# Altium schematic sheet Power_Management.SchDoc
size A4; SheetNumber: 3; SheetTotal: 4
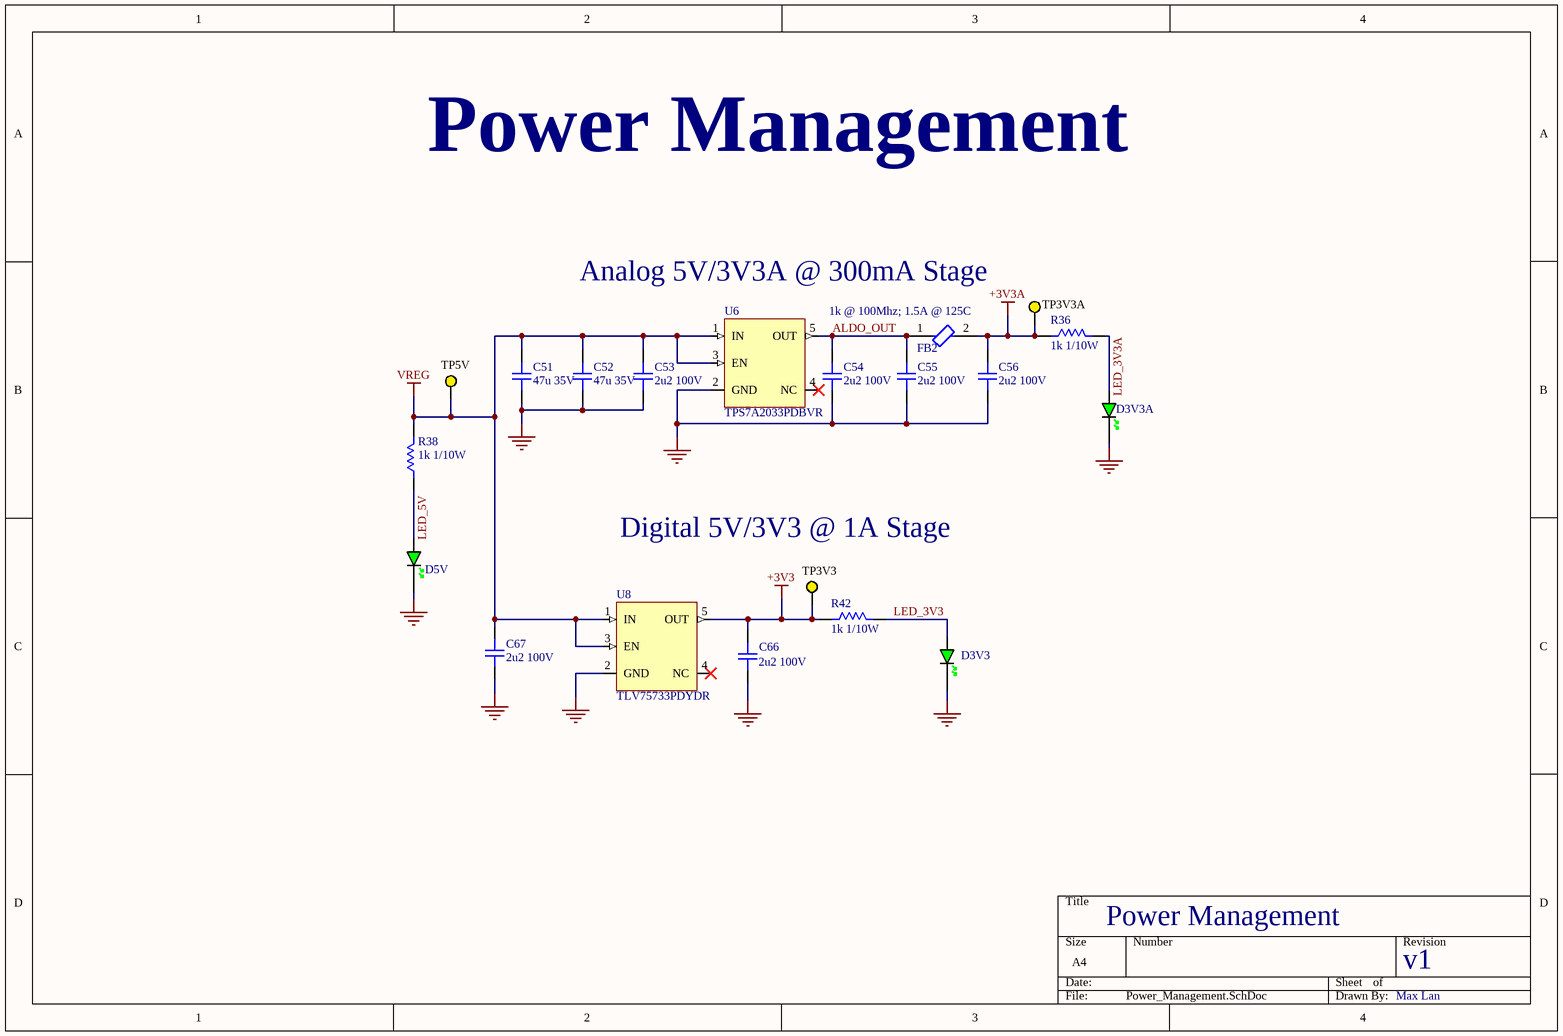
[diagram p0: Power_Management.SchDoc]

## Parts
C51  47u 35V  [CAP_2220]
C52  47u 35V  [CAP_2220]
C53  2u2 100V  [CAP_1210]
C54  2u2 100V  [CAP_1210]
C55  2u2 100V  [CAP_1210]
C56  2u2 100V  [CAP_1210]
C66  2u2 100V  [CAP_1210]
C67  2u2 100V  [CAP_1210]
D3V3  GREEN  [LED_0603_GREEN]  (value not drawn)
D3V3A  GREEN  [LED_0603_GREEN]  (value not drawn)
D5V  GREEN  [LED_0603_GREEN]  (value not drawn)
FB2  1k @ 100Mhz; 1.5A @ 125C  [FP-MPZ2012-MFG]
R36  1k 1/10W  [RES_0603]
R38  1k 1/10W  [RES_0603]
R42  1k 1/10W  [RES_0603]
TP3V3  5014  [KSTN-5014_V]  (value not drawn)
TP3V3A  5014  [KSTN-5014_V]  (value not drawn)
TP5V  5014  [KSTN-5014_V]  (value not drawn)
U6  TPS7A2033PDBVR  [TPS7A2033PDBVR]
U8  TLV75733PDYDR  [TLV75733PDYDR]

## Nets
+3V3: C66.2 R42.1 TP3V3.1 U8.5(OUT)
+3V3A: C56.2 FB2.2 R36.1 TP3V3A.1
GND: C51.1 C52.1 C53.1 C54.1 C55.1 C56.1 C66.1 C67.1 D3V3.K D3V3A.K D5V.K U6.2(GND) U8.2(GND)
VREG: C51.2 C52.2 C53.2 C67.2 R38.1 TP5V.1 U6.1(IN) U6.3(EN) U8.1(IN) U8.3(EN)
ALDO_OUT: C54.2 C55.2 FB2.1 U6.5(OUT)
LED_3V3: D3V3.A R42.2
LED_3V3A: D3V3A.A R36.2
LED_5V: D5V.A R38.2

Not connected (* = marked no-connect by the designer): U6 4(NC)*; U8 4(NC)*

## Notes on the sheet
- Power Management
- Analog 5V/3V3A @ 300mA Stage
- Digital 5V/3V3 @ 1A Stage
- v1
- Max Lan

## Library data of the parts
C51 C52 = C5750X7R1V476M230KC: MLCC - SMD/SMT 2220 35VDC 47uF 20% X7R; Manufactuer Name: TDK; ComponentLink1Description: Datasheet Link; ComponentLink1URL: https://product.tdk.com/system/files/dam/doc/product/capacitor/ceramic/mlcc/catalog/mlcc_commercial_highvoltage_en.pdf; Distributor Name: Mouser; ComponentLink2Description: Distributor Link; ComponentLink2URL: https://www.mouser.tw/zh/ProductDetail/TDK/C5750X7R1V476M230KC?qs=rSMjJ%252B1ewcSIfs95ZgB3Sw%3D%3D
C53-C56 C66 C67 = C1210C225J1RACAUTO: Multilayer Ceramic Capacitors MLCC - SMD/SMT 100V 2.2uF X7R 1210 5% AEC-Q200; Manufacturer: KEMET; Rating: 2.2uF 100V X7R 1210 5%; Manufacturer Part Number: C1210C225J1RACAUTO; Distributor Link: https://www.mouser.tw/en/ProductDetail/KEMET/C1210C225J1RACAUTO?qs=sGAEpiMZZMvsSlwiRhF8qtbmv%2FbKa1yYzrRuCBjX9aFrg%252BEkfh5A0g%3D%3D; Datasheet Link: https://www.mouser.tw/datasheet/3/508/1/KEM_C1023_X7R_AUTO_SMD.pdf; Dielectric: *
D3V3 D3V3A D5V = LED_0603_GREEN: LED 0603 GREEN SMD
FB2 = CMP-08257-000025-1: FERRITE BEAD 1 KOHM 0805 1LN; Tolerance: 25%; Number of Lines: 1; DC Resistance (DCR): 150mR; Impedance: 1kR; Case Code (Metric): 2012; Mount: Surface Mount; Case/Package: 0805; Case Code (Imperial): 0805; Max Current Rating: 1.5A; Height: 0.041inch; Max DC Current: 1.5A; Min Operating Temperature: -55°C; Length: 0.079inch; Width: 1.25mm; Ratings: AEC-Q200; Packaging: Tape and Reel; RoHS Compliant: Yes; Termination: SMD/SMT; Test Frequency: 100MHz; Package Quantity: 4000; Weight: 0.000194oz; Max Operating Temperature: 125°C; Lead Free: Lead Free
R36 R38 R42 = CR0603-FX-1001EPF: Thick Film Resistors - SMD Res 0603 1k 1% 100mW TC100 low lead; Manufacturer: Bourns; Values: 1k 1% 1/10W 0603; Manufacturer Part Number: CR0603-FX-1001EPF; Distributor Link: https://www.mouser.tw/en/ProductDetail/Bourns/CR0603-FX-1001EPF?qs=sGAEpiMZZMvdGkrng054t2cqbZCzJY7NyLPI0qsjVVoXr8t57oNyzw%3D%3D; Datasheet Link: https://www.mouser.tw/datasheet/3/40/1/CR-PF.pdf
TP3V3 TP3V3A TP5V = CMP-1672-00006-4: Test Point, Yellow, Through Hole, RoHS, Bulk; Manufacturer: Keystone; PackageDescription: 1-Pin Through Hole Device, Dia 3.17 mm; REACH SVHC: No SVHC; ComponentLink2Description: Datasheet; ComponentLink2URL: http://www.keyelco.com/product-pdf.cfm?p=1323; Package Quantity: 100; Colour: Yellow; Height: 8.12 mm; RoHSCompliant: true; Contact Material: Bronze; Mount: Through Hole; Contact Plating: Silver; ComponentLink1URL: http://www.keyelco.com/; Packaging: Bulk; Mounting Technology: Through Hole; PackageReference: 5014; ComponentLink1Description: Manufacturer URL; DatasheetVersion: Rev. F, 12/2013
U6 = TPS7A2033PDBVR: LDO Voltage Regulators 300-mA ultra-low-noi se low-IQ low-dropo / 300mA, Ultra-Low-Noise, Low-IQ, High PSRR LDO; Manufacturer Name: Texas Instruments; Ratings: 300mA  Input voltage range: 1.6V to 6.0V Output voltage range: 0.8V to 5.5V; Manufacturer Part Number: TPS7A2033PDBVR; ComponentLink1Description: Datasheet Link; ComponentLink1URL: https://www.ti.com/lit/gpn/tps7a20; ComponentLink2Description: Manufacturer Link; ComponentLink2URL: https://www.mouser.tw/en/ProductDetail/Texas-Instruments/TPS7A2033PDBVR?qs=hd1VzrDQEGjk%2FOBnRfKB4A%3D%3D&utm_id=22416807323&utm_source=google&utm_medium=cpc&utm_marketing_tactic=apaccorp&gad_source=1&gad_campaignid=22410328932&gbraid=0AAAAADn_wf1iU6pLOROSll7N1bOE2OfPs&gclid=CjwKCAjwj7HTBhBiEiwA8s35OiejKBh_upysW4k-S-XykRFXSFhPMWyPmweCSWJvNlSOyNgoqC3kFBoCQT8QAvD_BwE
U8 = TLV75733PDYDR: LDO Voltage Regulators 1-A low-IQ high-acc uracy low-dropout (L / Low dropout: / – 425mV (maximum) at 1A (3.3VOUT) / • Input voltage range: 1.45V to 5.5V; Manufacturer Name: Texas Instruments; ComponentLink1Description: Distributor Link; ComponentLink1URL: https://www.mouser.tw/en/ProductDetail/Texas-Instruments/TLV75733PDYDR?qs=ZcfC38r4PovvOY4HwNOrpQ%3D%3D; ComponentLink2Description: Datasheet Link; ComponentLink2URL: https://www.ti.com/lit/gpn/tlv757p; Ratings: Input voltage range: 1.45V to 5.5V